# EAGLE design arduino_Uno_STIM_ShieldII_v4 (EAGLE 9.6.2)
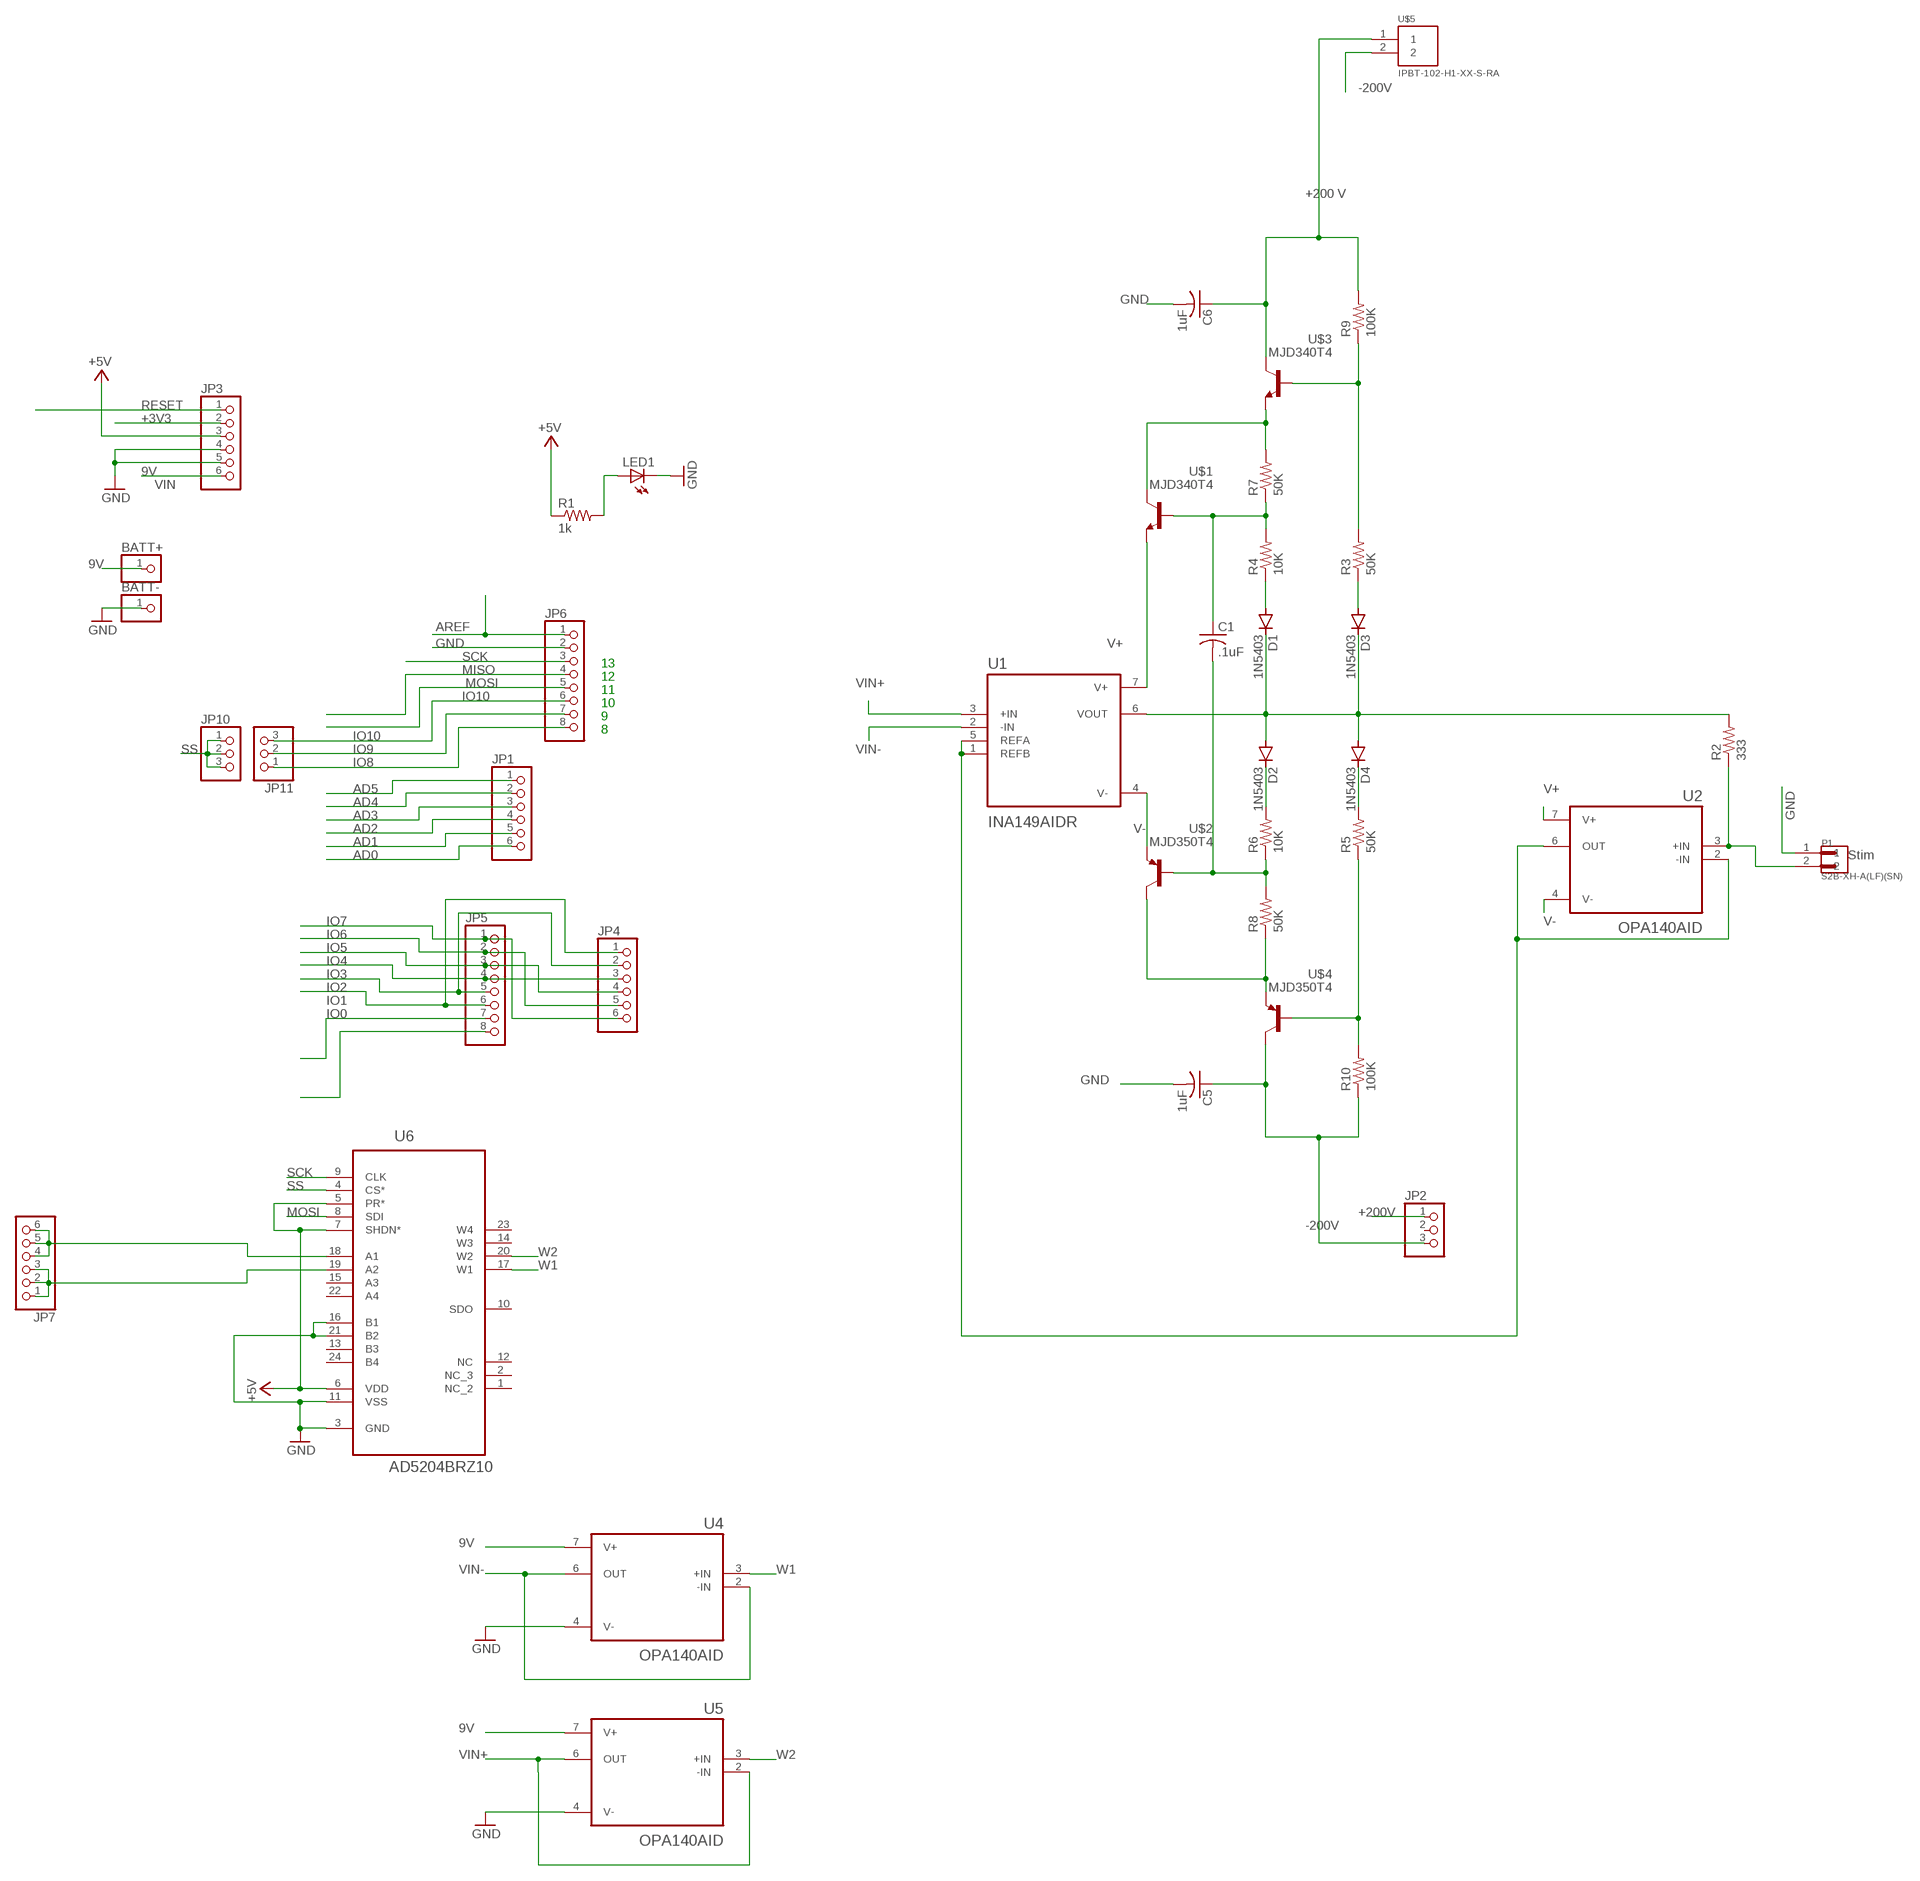
[diagram p0: schematic, sheet 1]

## Parts
BATT+  PINHD-1X1  [1X01]
BATT-  PINHD-1X1  [1X01]
C1  .1uF  C-USC1206  [C1206]
C5  1uF  C-USC2220K  [C2220K]
C6  1uF  C-USC2220K  [C2220K]
D1  1N5403  1N5400  [DO201-15]
D2  1N5403  1N5400  [DO201-15]
D3  1N5403  1N5400  [DO201-15]
D4  1N5403  1N5400  [DO201-15]
JP1  PINHD-1X6CB  [1X06-CLEANBIG]
JP2  PINHD-1X3  [1X03]
JP3  PINHD-1X6CB  [1X06-CLEANBIG]
JP4  PINHD-1X6CB  [1X06-CLEANBIG]
JP5  PINHD-1X8CLEANBIG  [1X08-CLEANBIG]
JP6  PINHD-1X8CLEANBIG  [1X08-CLEANBIG]
JP7  PINHD-1X6CB  [1X06-CLEANBIG]
JP10  PINHD-1X3CB  [1X03-CLEANBIG]
JP11  PINHD-1X3CB  [1X03-CLEANBIG]
LED1  LEDCHIPLED_1206  [CHIPLED_1206]
P1  S2B-XH-A(LF)(SN)  [JST_S2B-XH-A(LF)(SN)]
R1  1k  R-US_M0805  [M0805]
R2  333  R-US_M1206  [M1206]
R3  50K  R-US_M1206  [M1206]
R4  10K  R-US_M1206  [M1206]
R5  50K  R-US_M1206  [M1206]
R6  10K  R-US_M1206  [M1206]
R7  50K  R-US_M1206  [M1206]
R8  50K  R-US_M1206  [M1206]
R9  100K  R-US_M1206  [M1206]
R10  100K  R-US_M1206  [M1206]
U1  INA149AIDR  [SOIC127P599X175-8N]
U2  OPA140AID  [SOIC127P599X175-8N]
U4  OPA140AID  [SOIC127P599X175-8N]
U5  OPA140AID  [SOIC127P599X175-8N]
U6  AD5204BRZ10  [SOIC127P1032X265-24N]
U$1  MJD340T4  [TO229P990X238-4N]
U$2  MJD350T4  [TO229P990X238-4N]
U$3  MJD340T4  [TO229P990X238-4N]
U$4  MJD350T4  [TO229P990X238-4N]
U$5  IPBT-102-H1-XX-S-RA  [IPBT-102-H1-XX-S-RA]

## Nets
9V: BATT+.1 JP3.6 U4.7(V+) U5.7(V+)
+3V3: JP3.2
+5V: JP3.3 R1.1 U6.5(PR*) U6.6(VDD) U6.7(SHDN*)
+200V [Power]: C6.1 JP2.1 R9.2 U$3.4(C) U$5.1
-200V [Power]: C5.1 JP2.3 R10.1 U$4.4(C) U$5.2
AD0: JP1.6
AD1: JP1.5
AD2: JP1.4
AD3: JP1.3
AD4: JP1.2
AD5: JP1.1
AREF: JP6.1
GND [Power]: BATT-.1 C5.2 C6.2 JP3.4 JP3.5 JP6.2 LED1.C P1.1 U4.4(V-) U5.4(V-) U6.3(GND) U6.11(VSS) U6.16(B1) U6.21(B2)
IO0: JP5.8
IO1: JP5.7
IO2: JP4.1 JP5.6
IO3: JP4.2 JP5.5
IO4: JP4.3 JP5.4
IO5: JP4.4 JP5.3
IO6: JP4.5 JP5.2
IO7: JP4.6 JP5.1
IO8: JP6.8 JP11.1
IO9: JP6.7 JP11.2
IO10: JP6.6 JP11.3
MISO: JP6.4
MOSI: JP6.5 U6.8(SDI)
N$1: D1.C D2.A D3.C D4.A R2.2 U1.6(VOUT)
N$2: D3.A R3.1
N$3: LED1.A R1.2
N$4: JP7.4 JP7.5 JP7.6 U6.18(A1)
N$5: JP7.1 JP7.2 JP7.3 U6.19(A2)
N$6: D1.A R4.1
N$7: P1.2 R2.1 U2.3(+IN)
N$8: D4.C R5.2
N$9: D2.C R6.2
N$10: C1.2 R6.1 R8.2 U$2.1(B)
N$13: C1.1 R4.2 R7.1 U$1.1(B)
N$14: R7.2 U$1.4(C) U$3.3(E)
N$15: R8.1 U$2.4(C) U$4.3(E)
N$16: R3.2 R9.1 U$3.1(B)
N$17: R5.1 R10.2 U$4.1(B)
N$20: U1.1(REFB) U1.5(REFA) U2.2(-IN) U2.6(OUT)
RESET: JP3.1
SCK: JP6.3 U6.9(CLK)
SS: JP10.1 JP10.2 JP10.3 U6.4(CS*)
V+: U1.7(V+) U2.7(V+) U$1.3(E)
V-: U1.4(V-) U2.4(V-) U$2.3(E)
VIN+: U1.3(+IN) U5.2(-IN) U5.6(OUT)
VIN-: U1.2(-IN) U4.2(-IN) U4.6(OUT)
W1: U4.3(+IN) U6.17(W1)
W2: U5.3(+IN) U6.20(W2)
Unconnected: JP2.2 U6.1(NC_2) U6.2(NC_3) U6.10(SDO) U6.12(NC) U6.13(B3) U6.14(W3) U6.15(A3) U6.22(A4) U6.23(W4) U6.24(B4)

## Notes on the sheet
- +200 V
- VIN
- 13
- 12
- 11
- 10
- 9
- 8
- Stim

## Library data of the parts
BATT+ BATT- = adafruit:PINHD-1X1: Pin header 1x1 for 0.1" spacing With round pins
C1 C5 C6 = adafruit:C-US: CAPACITOR, American symbol
D1-D4 = diode:1N5400: DIODE standard rectifier, 3 A, 50 V (Motorola)
JP1 JP3 JP4 JP7 = adafruit:PINHD-1X6: PIN HEADER
JP2 JP10 JP11 = adafruit:PINHD-1X3: PIN HEADER
JP5 JP6 = adafruit:PINHD-1X8: PIN HEADER
LED1 = adafruit:LED: LED OSRAM: - CHIPLED LG R971, LG N971, LY N971, LG Q971, LY Q971, LO R971, LY R971 LH N974, LH R974 LS Q976, LO Q976, LY Q976 LO Q996 - Hyper CHIPLED LW Q18S LB Q993, LB Q99A, LB R99A - SideLED LS A670, LO A670, LY A670, LG A670, LP A670 LB A673, LV A673, LT A673, LW A673 LH A674 LY A675 LS A676, LA A676, LO A676, LY A676, LW A676 LS A679, LY A679, LG A679 - Hyper Micro SIDELED® LS Y876, LA Y876, LO Y876, LY Y876 LT Y87S - SmartLED LW L88C, LW L88S LB L89C, LB L89S, LG L890 LS L89K, LO L89K, LY L89K LS L896, LA L896, LO L896, LY L896 - TOPLED LS T670, LO T670, LY T670, LG T670, LP T670 LSG T670, LSP T670, LSY T670, LOP T670, LYG T670 LG T671, LOG T671, LSG T671 LB T673, LV T673, LT T673, LW T673 LH T674 LS T676, LA T676, LO T676, LY T676, LB T676, LH T676, LSB T676, LW T676 LB T67C, LV T67C, LT T67C, LS T67K, LO T67K, LY T67K, LW E67C LS E67B, LA E67B, LO E67B, LY E67B, LB E67C, LV E67C, LT E67C LW T67C LS T679, LY T679, LG T679 LS T770, LO T770, LY T770, LG T770, LP T770 LB T773, LV T773, LT T773, LW T773 LH T774 LS E675, LA E675, LY E675, LS T675 LS T776, LA T776, LO T776, LY T776, LB T776 LHGB T686 LT T68C, LB T68C - Hyper Mini TOPLED® LB M676 - Mini TOPLED Santana® LG M470 LS M47K, LO M47K, LY M47K Source: http://www.osram.convergy.de/
P1 = S2B-XH-A_LF__SN_:S2B-XH-A(LF)(SN): XH Series 2.5mm 2 Position Through Hole Shrouded Header Connector; DESCRIPTION: Connector Header Through Hole, Right Angle 2 position 0.098 (2.50mm); DIGI-KEY_PART_NUMBER: 455-2257-ND; MF: JST Sales; MP: S2B-XH-A(LF)(SN); PACKAGE: None
R1-R10 = adafruit:R-US_: RESISTOR, American symbol
U1 = INA149AIDR:INA149AIDR: Check prices <https://pricing.snapeda.com/parts/INA149AIDR/Texas%20Instruments/view-part?ref=eda>; AVAILABILITY: Good; DESCRIPTION: High Common Mode Voltage Difference Amplifier 8-SOIC -40 to 125; MF: Texas Instruments; MP: INA149AIDR; PACKAGE: SOIC-8 Texas Instruments; PRICE: None; PURCHASE-URL: https://pricing.snapeda.com/search/part/INA149AIDR/?ref=eda
U2 U4 U5 = OPA140AID:OPA140AID; AVAILABILITY: Unavailable; DESCRIPTION: Single, 11MHz, Single Supply, Low Noise, Precision, Rail-to-Rail Output, JFET Amplifier 8-SOIC -40 to 125; MF: Texas Instruments; MP: OPA140AID; PACKAGE: SOIC-8 Texas Instruments; PRICE: None; PURCHASE-URL: https://pricing.snapeda.com/search/part/OPA140AID/?ref=eda
U6 = AD5204BRZ10:AD5204BRZ10: 4-Channel Digital Potentiometer; DESCRIPTION: Digital Potentiometer 100k Ohm 4 Circuit 256 Taps SPI Interface 24-SOIC; DIGI-KEY_PART_NUMBER: AD5204BRZ100-ND; MF: Analog Devices; MP: AD5204BRZ10; PACKAGE: SOIC -24 Analog Devices; PURCHASE-URL: https://pricing.snapeda.com/search/part/AD5204BRZ10/?ref=eda
U$1 U$3 = TransistorLib:MJD340T4
U$2 U$4 = TransistorLib:MJD350T4
U$5 = IPBT-102-H1-XX-S-RA:IPBT-102-H1-XX-S-RA: .165 SINGLE ROW TERMINAL ASSEMBLY.

## Net classes
0 default: width 0.203 mm, drill 0.305 mm, clearance 0.305 mm
1 Power: width 0.356 mm, clearance 0.356 mm

## Board
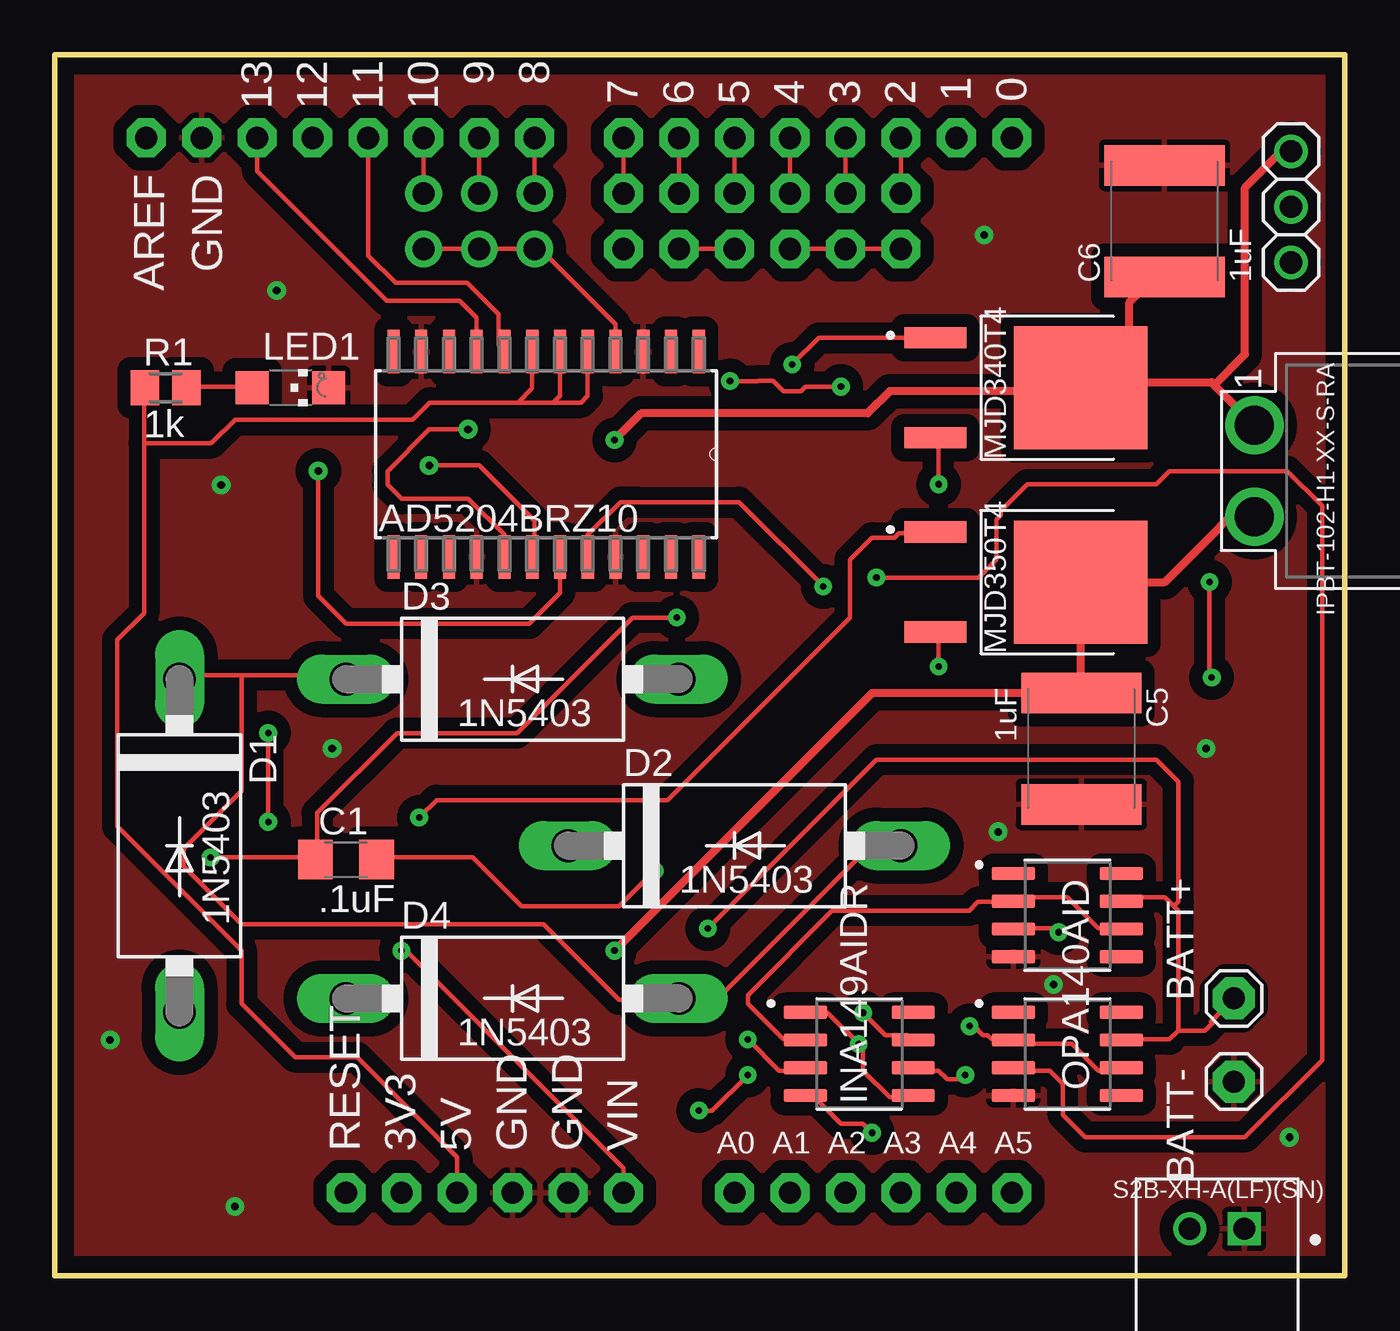
[diagram p1: board, top side]
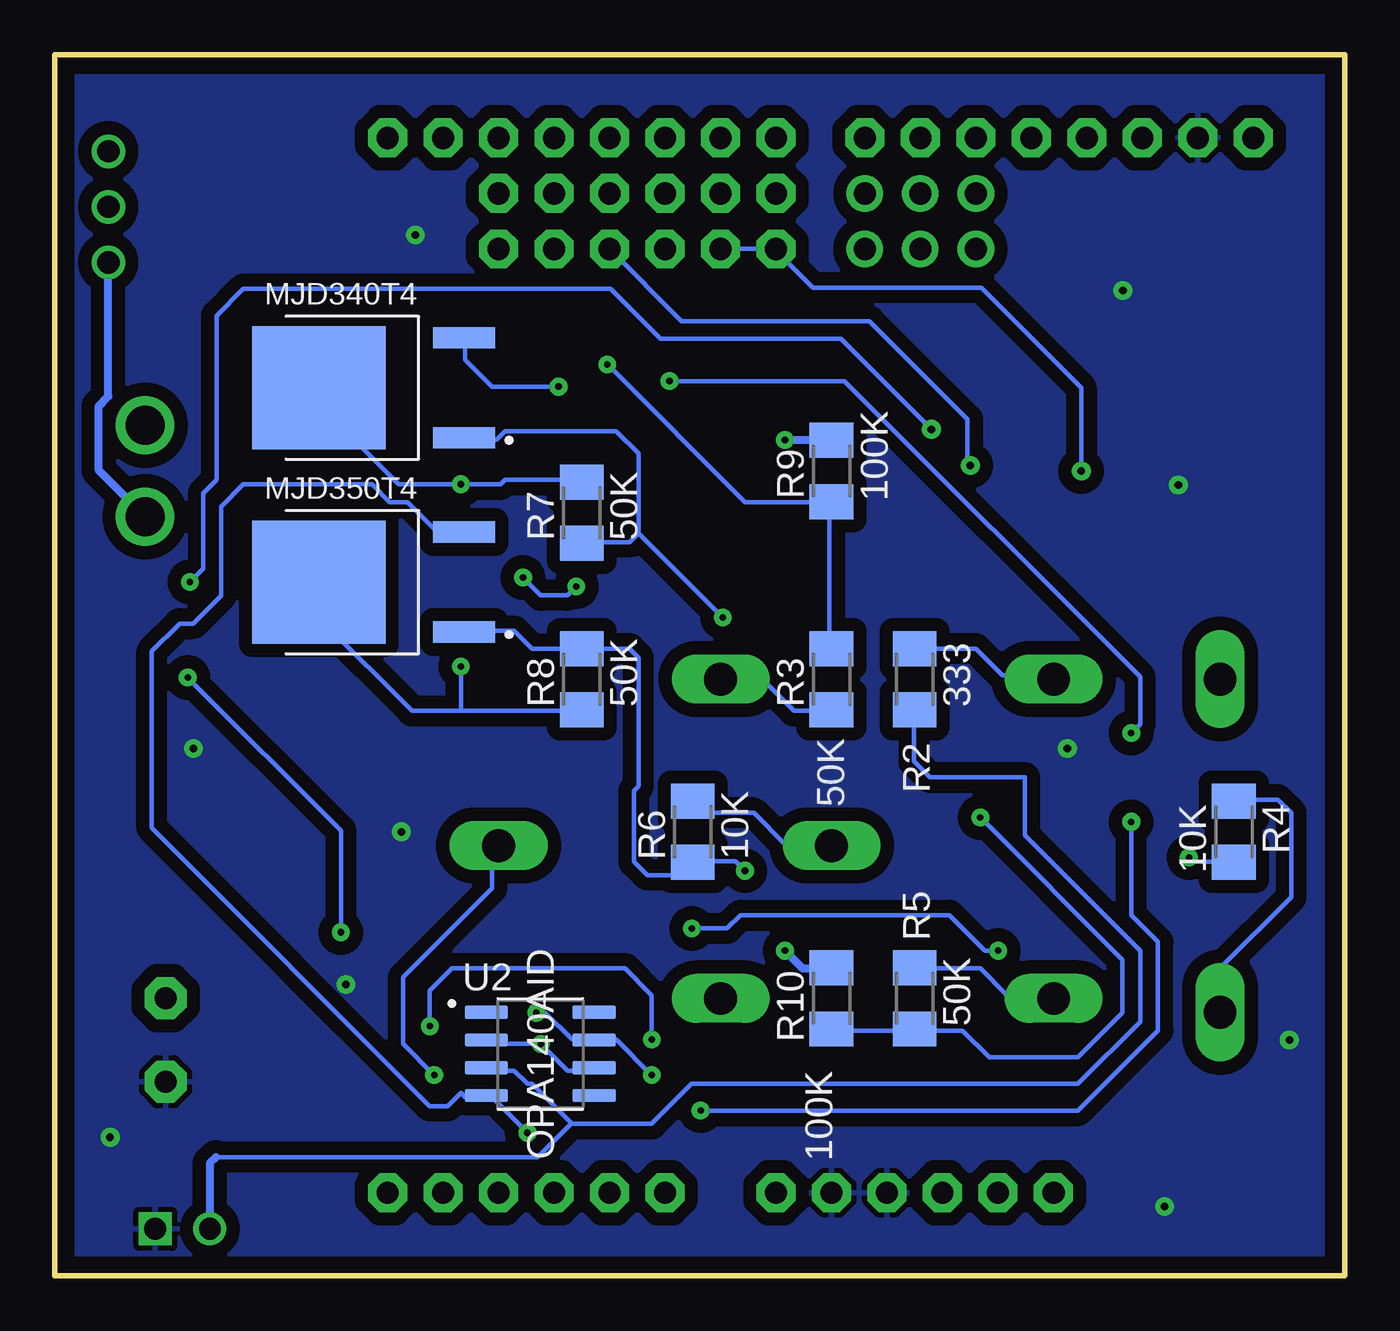
[diagram p2: board, bottom side, seen from below]

Size 59.05 x 55.88 mm. Coordinates in mm from the lower left corner, seen from the top.
Outline: 0,55.88 59.05,55.88 59.05,0 0,0 0,55.88
Copper layers (1*16): Top 0.035mm / dielectric 1.5mm / Bottom 0.035mm
Design rules "default *": minimum track width 8mil, minimum drill 12mil, track to track 24mil, track to pad 24mil, pad to pad 24mil, via to via 24mil, smd to smd 24mil, copper to edge 30mil, drill to drill 12mil, minimum pad ring 10mil, minimum via ring 10mil, stop-mask expansion 1mil, vias tented up to drill 0mil, thermal gap 10mil

### Footprints (pad centres in the part's own frame; a part is rotated, then mirrored left to right if it is on the bottom)
1X01 = drill 1.016 pad 1.93 octagon: 1 0,0
C1206 = smd 1.6 x 1.8: 1 -1.4,0; 2 1.4,0
C2220K = smd 1.85 x 5.5: 1 -2.55,0; 2 2.55,0
DO201-15 = drill 1.499 long: A 7.62,0; C -7.62,0
1X06-CLEANBIG = drill 1.016 pad 1.778 octagon: 1 -6.35,0; 2 -3.81,0; 3 -1.27,0; 4 1.27,0; 5 3.81,0; 6 6.35,0
1X03 = drill 1.016: 1 -2.54,0; 2 0,0; 3 2.54,0
1X08-CLEANBIG = drill 1.016 pad 1.778 octagon: 1 -8.89,0; 2 -6.35,0; 3 -3.81,0; 4 -1.27,0; 5 1.27,0; 6 3.81,0; 7 6.35,0; 8 8.89,0
1X03-CLEANBIG = drill 1.016 pad 1.676: 1 -2.54,0; 2 0,0; 3 2.54,0
CHIPLED_1206 = smd 1.5 x 1.5: A 0,-1.75; C 0,1.75
JST_S2B-XH-A(LF)(SN) = drill 1 square: 1 -1.25,0 | drill 1: 2 1.25,0
M0805 = smd 1.3 x 1.6: 1 -0.95,0; 2 0.95,0
M1206 = smd 1.6 x 2: 1 -1.4,0; 2 1.4,0
SOIC127P599X175-8N = smd 1.97 x 0.6: 1 -2.47,1.905; 2 -2.47,0.635; 3 -2.47,-0.635; 4 -2.47,-1.905; 5 2.47,-1.905; 6 2.47,-0.635; 7 2.47,0.635; 8 2.47,1.905
SOIC127P1032X265-24N = smd 1.981 x 0.559: 1 -4.699,6.985; 2 -4.699,5.715; 3 -4.699,4.445; 4 -4.699,3.175; 5 -4.699,1.905; 6 -4.699,0.635; 7 -4.699,-0.635; 8 -4.699,-1.905; 9 -4.699,-3.175; 10 -4.699,-4.445; 11 -4.699,-5.715; 12 -4.699,-6.985; 13 4.699,-6.985; 14 4.699,-5.715; 15 4.699,-4.445; 16 4.699,-3.175; 17 4.699,-1.905; 18 4.699,-0.635; 19 4.699,0.635; 20 4.699,1.905; 21 4.699,3.175; 22 4.699,4.445; 23 4.699,5.715; 24 4.699,6.985
TO229P990X238-4N = smd 2.83 x 0.97: 1 -4.14,2.29; 3 -4.14,-2.29 | smd 6.09 x 5.63: 4 2.51,0
IPBT-102-H1-XX-S-RA = drill 1.778 pad 2.54: 1 -2.095,-11.76; 2 2.095,-11.76

### Placement (x,y rotation side)
BATT+  53.97,12.7 0 top
BATT-  53.97,8.89 0 top
C1  13.34,19.05 0 top
C5  46.99,24.13 270 top
C6  50.8,48.26 90 top
D1  5.71,19.68 270 top
D2  31.11,19.68 0 top
D3  20.96,27.3 0 top
D4  20.96,12.7 0 top
JP1  37.47,3.81 0 top
JP2  56.59,48.91 270 top
JP3  19.68,3.81 0 top
JP4  32.39,49.53 180 top
JP5  34.92,52.07 0 top
JP6  13.08,52.07 0 top
JP7  32.39,46.99 0 top
JP10  19.43,46.99 0 top
JP11  19.43,49.53 180 top
LED1  10.8,40.64 270 top
P1  53.2,2.16 180 top
R1  5.08,40.64 0 top
R2  19.68,27.3 90 bottom
R3  23.5,27.3 90 bottom
R4  5.08,20.32 270 bottom
R5  19.68,12.7 90 bottom
R6  29.85,20.32 90 bottom
R7  34.92,34.93 90 bottom
R8  34.92,27.3 90 bottom
R9  23.5,36.83 90 bottom
R10  23.5,12.7 270 bottom
U1  36.83,10.16 0 top
U2  36.83,10.16 0 bottom
U4  46.36,16.51 0 top
U5  46.36,10.16 0 top
U6  22.49,37.6 270 top
U$1  44.45,40.64 180 bottom
U$2  44.45,31.75 180 bottom
U$3  44.45,40.64 0 top
U$4  44.45,31.75 0 top
U$5  66.67,36.83 270 top

### Tracks (layer width: path | path; a pad name or v marks a point on that pad's centre or on a via)
9V  (via drill 0.3)
  Top 0.203: 51.44,11.23 51.03,10.82 49,10.82 U5.7 | 51.44,11.23 52.65,11.23 53.06,11.63 52.91,11.63 BATT+.1 | 51.23,16.92 51.44,16.71 51.44,11.23 | 51.23,16.92 50.83,17.32 49,17.32 U4.7 | v15.88,14.88 16.08,14.88 26.04,4.93 JP3.6 | v29.9,15.9 37.62,23.62 50.42,23.62 51.44,22.61 51.44,17.12 51.23,16.92
  Bottom 0.203: v15.88,14.88 16.49,14.88 18.11,16.51 27.66,16.51 28.27,15.9 v29.9,15.9
+5V
  Top 0.203: R1.1 4.09,40.49 4.09,38.1 | 4.09,38.1 4.09,30.33 2.87,29.11 2.87,20.57 8.56,14.88 8.56,12.45 11,10.01 13.84,10.01 18.42,5.44 JP3.3 | U6.6 23.13,40.27 22.82,39.96 | 4.09,38.1 7.18,38.1 8.26,39.18 16.38,39.18 17.16,39.96 21.21,39.96 | 21.21,39.96 22.82,39.96 | 22.82,39.96 24.09,39.96 24.4,40.27 U6.5 | 21.21,39.96 21.86,40.61 U6.7
+200V  (via drill 0.3)
  Top 0.356: v25.63,38.25 26.85,39.47 37.21,39.47 38.23,40.49 46.76,40.49 U$3.4 | 49.2,40.89 47.17,40.89 46.97,40.69 U$3.4 | 49.2,40.89 49.2,44.55 50.22,45.57 50.62,45.57 C6.1 | 49.2,40.89 U$3.4 | 53.08,40.76 52.95,40.89 49.2,40.89 | 53.08,40.76 U$5.1 | 53.08,40.76 54.48,42.16 54.48,49.78 56.15,51.45 JP2.1
  Bottom 0.356: v25.63,38.25 23.6,38.25 R9.2
-200V  (via drill 0.3)
  Top 0.356: U$4.4 50.83,31.75 53.34,34.27 53.34,34.29 53.78,34.74 U$5.2 | v25.63,14.88 37.41,26.67 46.97,26.67 C5.1 46.97,26.87 U$4.4 | U$4.4
  Bottom 0.356: v25.63,14.88 24.82,14.07 23.6,14.07 R10.1 | JP2.3 56.59,40.25 57.04,39.8 57.04,36.86 U$5.2
GND  (via drill 0.35)
  other vias: 43.18,20.32 52.7,24.13 45.72,13.33 7.62,36.2 10.16,45.09 42.55,47.62 8.26,3.17 2.54,10.79 12.7,24.13 56.52,6.35
  pour Bottom (rank 2): -19.05,57.15 59.44,57.15 59.69,56.9 59.69,-1.27 -15.62,-1.27 -19.2,2.31 -19.05,2.93
  pour Top (rank 2): -19.05,57.15 59.69,57.15 59.69,-1.27 -19.05,-1.27
IO2
  Top 0.203: JP4.1 JP5.6
IO3
  Top 0.203: JP4.2 JP5.5
IO4
  Top 0.203: JP4.3 JP5.4
IO5
  Top 0.203: JP4.4 JP5.3
IO6
  Top 0.203: JP4.5 JP5.2
IO7
  Top 0.203: JP4.6 JP5.1
IO8
  Top 0.203: JP11.1 JP6.8
IO9
  Top 0.203: JP11.2 JP6.7
IO10
  Top 0.203: JP11.3 JP6.6
MOSI
  Top 0.203: JP6.5 14.35,46.69 15.6,45.44 18.88,45.44 20.31,44.01 20.31,42.58 U6.8
N$1  (via drill 0.3)
  Top 0.203: 8.56,27.48 5.71,27.48 D1.C | 8.56,27.48 13.23,27.48 D3.C | v41.68,9.2 41.48,8.99 40.87,8.99 40.46,9.4 39.45,9.4 U1.6 | D2.A 38.63,19.56 37.21,19.56 30.5,12.85 29.06,12.85 28.91,12.7 D4.A 28.47,12.65 25.83,12.65 22.38,16.1 8.56,16.1 5.92,18.75 5.92,19.56 8.56,22.2 8.56,27.48
  Bottom 0.203: R2.2 19.53,28.7 16.89,28.7 15.67,27.48 13.44,27.48 D3.C | v41.68,9.2 43.1,10.62 43.1,13.66 39.04,17.73 39.04,19.36 38.84,19.56 D2.A
N$2
  Bottom 0.203: R3.1 23.6,25.86 25.22,25.86 26.64,27.28 28.47,27.28 D3.A
N$3
  Top 0.203: LED1.A 8.97,40.69 6.12,40.69 R1.2
N$4  (via drill 0.35)
  Top 0.203: JP7.4 JP7.5 JP7.6 | v17.14,37.08 19.43,37.08 21.97,34.54 21.97,33.01 U6.18
  Bottom 0.203: JP7.4 30.35,43.69 21.76,43.69 17.28,39.21 17.28,37.21 v17.14,37.08
N$5  (via drill 0.35)
  Top 0.203: v12.07,36.83 12.07,31.11 13.34,29.84 21.72,29.84 23.13,31.26 U6.19 | JP7.2 JP7.3
  Bottom 0.203: v12.07,36.83 12.07,40.64 16.64,45.21 24.35,45.21 26.04,46.9 JP7.1 JP7.2
N$6
  Bottom 0.203: D1.A 5.71,14.07 2.46,17.32 2.46,21.18 3.07,21.79 4.9,21.79 R4.1
N$7
  Bottom 0.203: R2.1 19.74,25.86 19.74,23.55 19,22.81 14.66,22.81 14.66,20.17 9.37,14.88 9.37,11.63 12.22,8.79 29.9,8.79 31.72,6.96 35.38,6.96 | 35.38,6.96 37.21,8.79 37.41,8.79 38.02,9.4 39.24,9.4 U2.3 | 35.38,6.96 35.43,6.96 36.95,5.44 51.67,5.44
  Bottom 0.356: 51.67,5.44 51.95,5.15 P1.2
N$8
  Bottom 0.203: R5.2 19.53,14.07 16.69,14.07 15.47,12.85 13.44,12.85 D4.C
N$9
  Bottom 0.203: R6.2 29.02,21.18 27.05,21.18 25.63,19.76 23.6,19.76 D2.C
N$10  (via drill 0.3)
  Top 0.203: v27.46,18.54 25.83,16.92 21.36,16.92 19.13,19.15 14.86,19.15 C1.2
  Bottom 0.203: U$2.1 40.26,29.52 38.02,29.52 37.21,28.7 34.98,28.7 R8.2 34.77,28.7 32.74,28.7 32.33,28.3 32.33,22.4 32.54,22.2 32.54,18.95 31.93,18.34 30.39,18.34 R6.1 29.79,18.97 27.89,18.97 v27.46,18.54
N$13  (via drill 0.3)
  Top 0.203: v7.14,19.15 11.81,19.15 C1.1 12.01,19.15 12.01,21.18 15.67,24.84 21.16,24.84 26.44,30.12 v28.47,30.12
  Bottom 0.203: v7.14,19.15 6.93,18.95 5.11,18.95 R4.2 | 32.33,33.99 32.74,33.58 34.77,33.58 R7.1 | 32.33,33.99 32.33,37.64 33.35,38.66 38.43,38.66 38.84,38.25 40.26,38.25 U$1.1 | 32.33,33.99 v28.47,30.12
N$14  (via drill 0.3)
  Top 0.203: v40.46,36.22 40.46,38.25 U$3.3
  Bottom 0.203: R7.2 34.98,36.42 38.43,36.42 38.63,36.22 v40.46,36.22 43.31,36.22 46.76,39.68 46.76,40.49 U$1.4
N$15  (via drill 0.3)
  Top 0.203: v40.46,27.89 40.46,29.31 U$4.3
  Bottom 0.203: 40.46,25.86 42.7,25.86 46.76,29.92 46.76,31.75 U$2.4 | 40.46,25.86 34.98,25.86 R8.1 | 40.46,25.86 v40.46,27.89
N$16  (via drill 0.3)
  Top 0.203: v33.76,41.71 34.98,42.93 40.26,42.93 U$3.1
  Bottom 0.203: 23.6,35.41 23.6,28.91 R3.2 | v33.76,41.71 27.46,35.41 23.6,35.41 | 23.6,35.41 R9.1
N$17  (via drill 0.3)
  Top 0.203: v16.69,20.98 17.47,21.77 28.04,21.77 36.4,30.12 36.4,32.77 37.41,33.78 38.43,33.78 38.63,33.99 40.26,33.99 U$4.1
  Bottom 0.203: R10.2 23.39,11.23 19.74,11.23 R5.1 19.53,11.23 17.5,11.23 16.28,10.01 12.22,10.01 10.19,12.04 10.19,14.48 v16.69,20.98
N$20  (via drill 0.3)
  Top 0.203: U1.1 34.37,12.04 35.38,12.04 v36.81,10.62 37.01,10.41 37.01,9.4 38.23,8.18 39.24,8.18 U1.5
  Bottom 0.203: U2.6 34.37,9.4 35.59,9.4 v36.81,10.62 39.24,10.62 U2.2
SCK
  Top 0.203: JP6.3 9.27,50.55 15.19,44.63 18.54,44.63 19.32,43.85 U6.9
SS
  Top 0.203: U6.4 25.67,43.55 22.22,46.99 JP10.3 JP10.2 JP10.1
V+  (via drill 0.3)
  Top 0.203: v37.01,12.04 38.02,11.02 39.04,11.02 39.24,10.82 U1.7 | v35.99,40.69 34.37,40.69 34.16,40.49 33.35,40.49 32.88,40.96 32.2,40.96 32.18,40.95 v30.91,40.95 | v9.78,20.78 v9.78,24.84 | v29.49,7.57 30.1,7.57 v31.72,9.2
  Bottom 0.203: v37.01,12.04 36.6,12.04 35.38,10.82 34.37,10.82 U2.7 34.16,10.82 33.35,10.82 v31.72,9.2 | v35.99,40.69 39.04,40.69 40.26,41.91 40.26,42.93 U$1.3 | v30.91,40.95 22.91,40.95 9.37,27.41 9.37,25.25 v9.78,24.84 | v9.78,20.78 9.78,16.51 8.56,15.29 8.56,11.23 12.22,7.57 v29.49,7.57
V-  (via drill 0.3)
  Top 0.203: v37.41,6.55 37.01,6.96 35.99,6.96 34.77,8.18 34.37,8.18 U1.4
  Bottom 0.203: v37.41,6.55 39.24,8.38 U2.4 39.45,8.18 40.26,8.18 40.46,8.38 41.07,7.77 41.89,7.77 54.61,20.5 54.61,28.57 53.34,29.84 52.7,29.84 51.44,31.11 51.44,35.2 50.42,36.22 44.53,36.22 43.71,35.41 42.9,35.41 41.68,34.19 40.46,34.19 U$2.3
VIN+  (via drill 0.3)
  Top 0.203: v31.72,10.82 33.15,9.4 34.16,9.4 U1.3 | v41.89,11.43 42.09,11.43 42.49,11.02 42.7,11.02 42.9,10.82 43.71,10.82 U5.2 43.92,10.62 46.56,10.62 47.78,9.4 48.79,9.4 U5.6
  Bottom 0.203: v31.72,10.82 31.72,12.85 32.94,14.07 40.87,14.07 41.89,13.06 v41.89,11.43
VIN-
  Top 0.203: U1.2 34.16,10.82 33.35,10.82 31.72,12.45 31.72,12.85 35.59,16.71 41.86,16.71 42.27,17.12 43.71,17.12 U4.2 43.92,17.32 46.36,17.32 47.78,15.9 48.79,15.9 U4.6
W1  (via drill 0.3, 0.35)
  Top 0.203: v45.95,15.72 45.77,15.9 43.92,15.9 U4.3 | v52.96,27.38 52.86,27.48 v52.86,31.75 | v18.92,38.74 17.14,38.74 15.24,36.83 15.24,36.2 15.88,35.56 18.93,35.56 20.59,33.9 U6.17
  Bottom 0.203: v45.95,15.72 45.95,20.37 v52.96,27.38 | v52.86,31.75 52.25,32.36 52.25,35.81 51.64,36.42 51.64,43.94 50.42,45.16 33.61,45.16 31.32,42.88 23.06,42.88 v18.92,38.74
W2  (via drill 0.3)
  Top 0.203: v37.62,31.95 42.29,31.95 43.1,32.77 43.1,34.6 43.31,34.8 43.31,35 44.53,36.22 50.42,36.22 51.03,36.83 56.41,36.83 58.01,35.23 58.01,9.88 54.48,6.35 47.17,6.35 46.15,7.37 46.15,8.79 45.54,9.4 43.92,9.4 U5.3 | v35.18,31.55 31.32,35.41 26.67,35.41 26.54,35.41 25.9,35.41 24.4,33.9 U6.20
  Bottom 0.203: v37.62,31.95 36.81,31.14 35.59,31.14 v35.18,31.55

### Text on the board
tPlace: 13 | 12 | 11 | 10 | 9 | 8 | 1 | 0 | 7 | 6 | 5 | 4 | 3 | 2
tNames: AREF | GND | RESET | 3V3 | 5V | GND | GND | VIN | A0 | A1 | A2 | A3 | A4 | A5
bNames: OPA140AID
214bmp: D:/SmartProjects/Snc/a4_bn_logo2.bmp